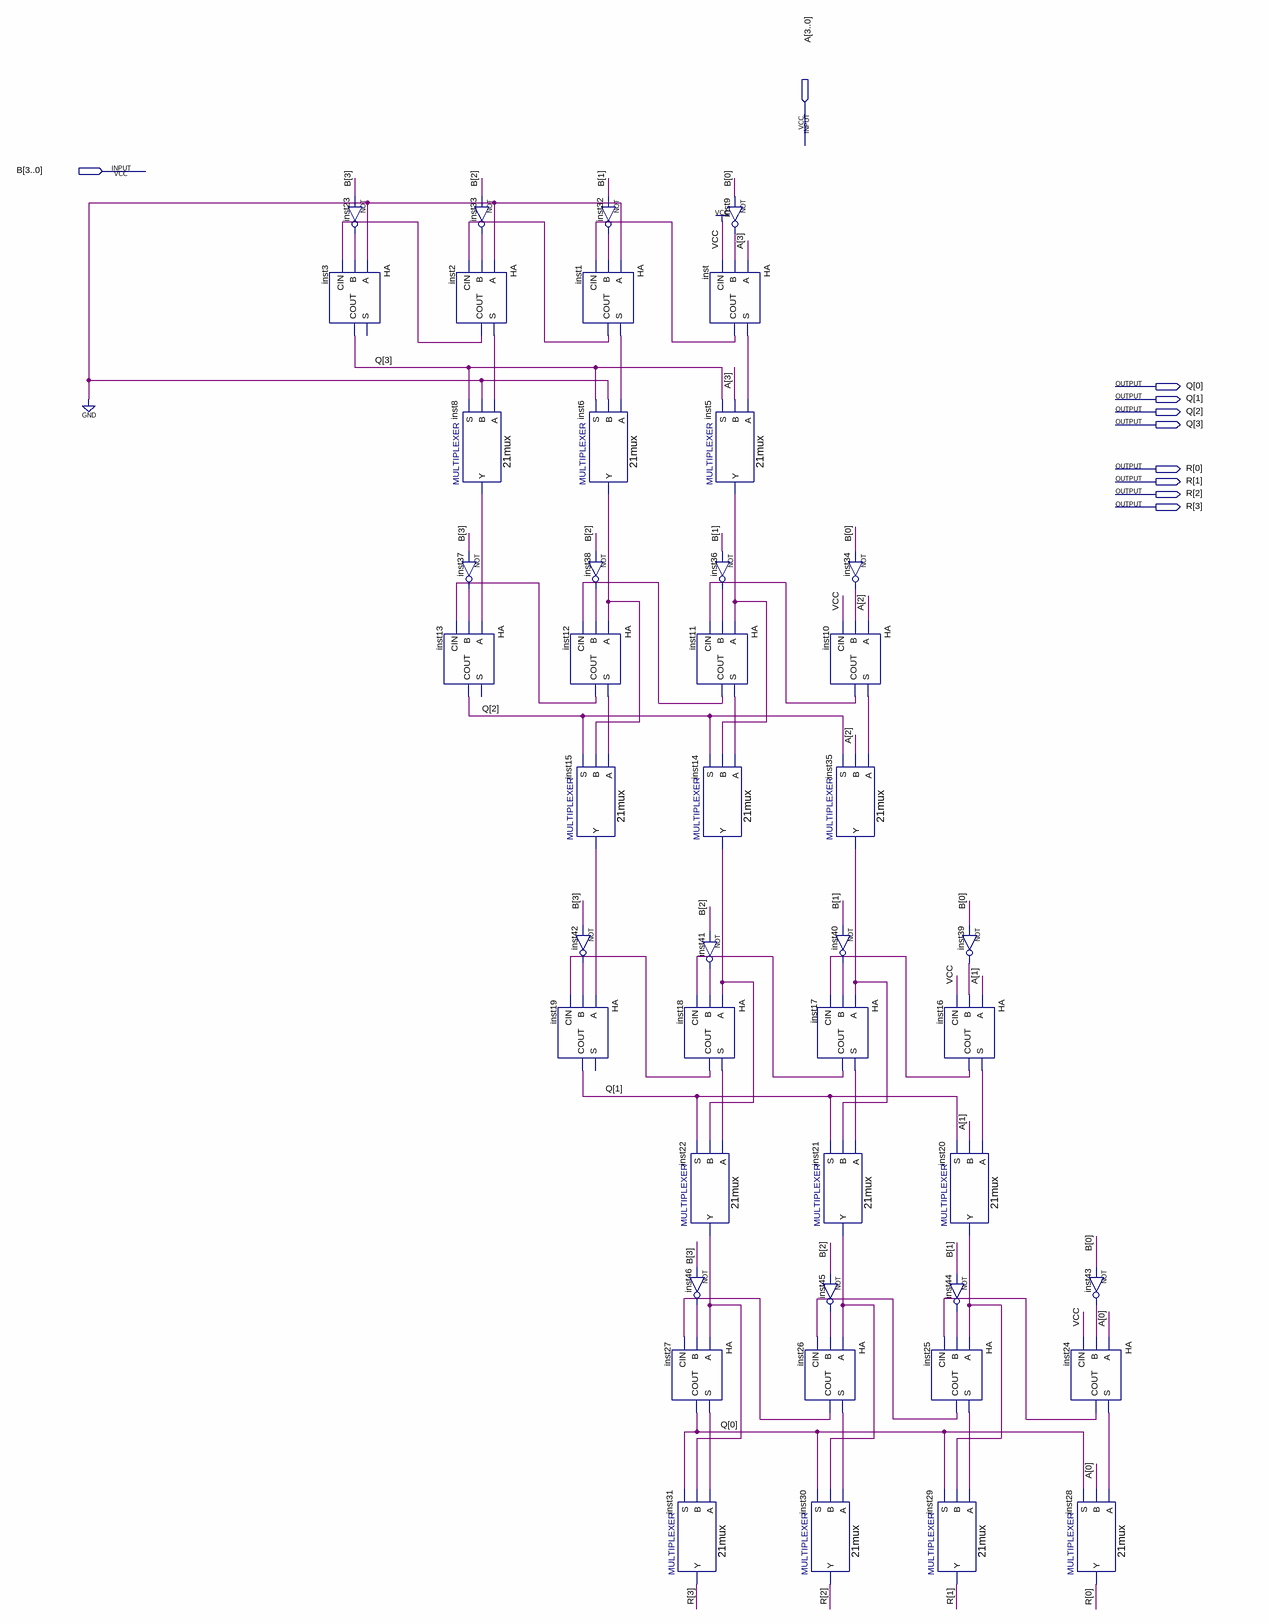
[diagram p0: schematic sheet]
// Quartus schematic division.bdf as structural Verilog: 45 symbols, 10 pins
module division (
  input  [3:0] A,
  input  [3:0] B,
  output [3:0] Q,
  output [3:0] R
);

  wire inst1_cout, inst1_s, inst2_cout, inst2_s, inst5_y, inst6_y, inst8_y, inst9_out, inst10_cout, inst10_s,
       inst11_cout, inst11_s, inst12_cout, inst12_s, inst14_y, inst15_y, inst16_cout, inst16_s, inst17_cout,
       inst17_s, inst18_cout, inst18_s, inst20_y, inst21_y, inst22_y, inst23_out, inst24_cout, inst24_s,
       inst25_cout, inst25_s, inst26_cout, inst26_s, inst27_s, inst32_out, inst33_out, inst34_out, inst35_y,
       inst36_out, inst37_out, inst38_out, inst39_out, inst40_out, inst41_out, inst42_out, inst43_out,
       inst44_out, inst45_out, inst46_out, inst_cout, inst_s;

  HA inst3 (.A(1'b0), .B(inst23_out), .CIN(inst2_cout), .COUT(Q[3]));  // open: S
  not inst23 (inst23_out, B[3]);
  not inst33 (inst33_out, B[2]);
  HA inst2 (.A(1'b0), .B(inst33_out), .CIN(inst1_cout), .S(inst2_s), .COUT(inst2_cout));
  \21mux  inst8 (.S(Q[3]), .B(1'b0), .A(inst2_s), .Y(inst8_y));
  not inst37 (inst37_out, B[3]);
  HA inst13 (.A(inst8_y), .B(inst37_out), .CIN(inst12_cout), .COUT(Q[2]));  // open: S
  HA inst1 (.A(1'b0), .B(inst32_out), .CIN(inst_cout), .S(inst1_s), .COUT(inst1_cout));
  HA inst12 (.A(inst6_y), .B(inst38_out), .CIN(inst11_cout), .S(inst12_s), .COUT(inst12_cout));
  \21mux  inst15 (.S(Q[2]), .B(inst6_y), .A(inst12_s), .Y(inst15_y));
  not inst42 (inst42_out, B[3]);
  HA inst19 (.A(inst15_y), .B(inst42_out), .CIN(inst18_cout), .COUT(Q[1]));  // open: S
  not inst32 (inst32_out, B[1]);
  \21mux  inst6 (.S(Q[3]), .B(1'b0), .A(inst1_s), .Y(inst6_y));
  not inst38 (inst38_out, B[2]);
  HA inst18 (.A(inst14_y), .B(inst41_out), .CIN(inst17_cout), .S(inst18_s), .COUT(inst18_cout));
  HA inst27 (.A(inst22_y), .B(inst46_out), .CIN(inst26_cout), .S(inst27_s), .COUT(Q[0]));
  \21mux  inst31 (.S(Q[0]), .B(inst22_y), .A(inst27_s), .Y(R[3]));
  not inst9 (inst9_out, B[0]);
  HA inst (.A(A[3]), .B(inst9_out), .CIN(1'b1), .S(inst_s), .COUT(inst_cout));
  \21mux  inst5 (.S(Q[3]), .B(A[3]), .A(inst_s), .Y(inst5_y));
  not inst36 (inst36_out, B[1]);
  HA inst11 (.A(inst5_y), .B(inst36_out), .CIN(inst10_cout), .S(inst11_s), .COUT(inst11_cout));
  \21mux  inst14 (.S(Q[2]), .B(inst5_y), .A(inst11_s), .Y(inst14_y));
  not inst41 (inst41_out, B[2]);
  \21mux  inst22 (.S(Q[1]), .B(inst14_y), .A(inst18_s), .Y(inst22_y));
  not inst46 (inst46_out, B[3]);
  HA inst10 (.A(A[2]), .B(inst34_out), .CIN(1'b1), .S(inst10_s), .COUT(inst10_cout));
  \21mux  inst35 (.S(Q[2]), .B(A[2]), .A(inst10_s), .Y(inst35_y));
  HA inst17 (.A(inst35_y), .B(inst40_out), .CIN(inst16_cout), .S(inst17_s), .COUT(inst17_cout));
  \21mux  inst21 (.S(Q[1]), .B(inst35_y), .A(inst17_s), .Y(inst21_y));
  not inst45 (inst45_out, B[2]);
  HA inst26 (.A(inst21_y), .B(inst45_out), .CIN(inst25_cout), .S(inst26_s), .COUT(inst26_cout));
  \21mux  inst30 (.S(Q[0]), .B(inst21_y), .A(inst26_s), .Y(R[2]));
  not inst34 (inst34_out, B[0]);
  not inst40 (inst40_out, B[1]);
  HA inst25 (.A(inst20_y), .B(inst44_out), .CIN(inst24_cout), .S(inst25_s), .COUT(inst25_cout));
  \21mux  inst29 (.S(Q[0]), .B(inst20_y), .A(inst25_s), .Y(R[1]));
  not inst39 (inst39_out, B[0]);
  HA inst16 (.A(A[1]), .B(inst39_out), .CIN(1'b1), .S(inst16_s), .COUT(inst16_cout));
  \21mux  inst20 (.S(Q[1]), .B(A[1]), .A(inst16_s), .Y(inst20_y));
  not inst44 (inst44_out, B[1]);
  HA inst24 (.A(A[0]), .B(inst43_out), .CIN(1'b1), .S(inst24_s), .COUT(inst24_cout));
  \21mux  inst28 (.S(Q[0]), .B(A[0]), .A(inst24_s), .Y(R[0]));
  not inst43 (inst43_out, B[0]);
endmodule
